# EAGLE design ZoomFloppy_v1.0a (EAGLE 7.7.0)
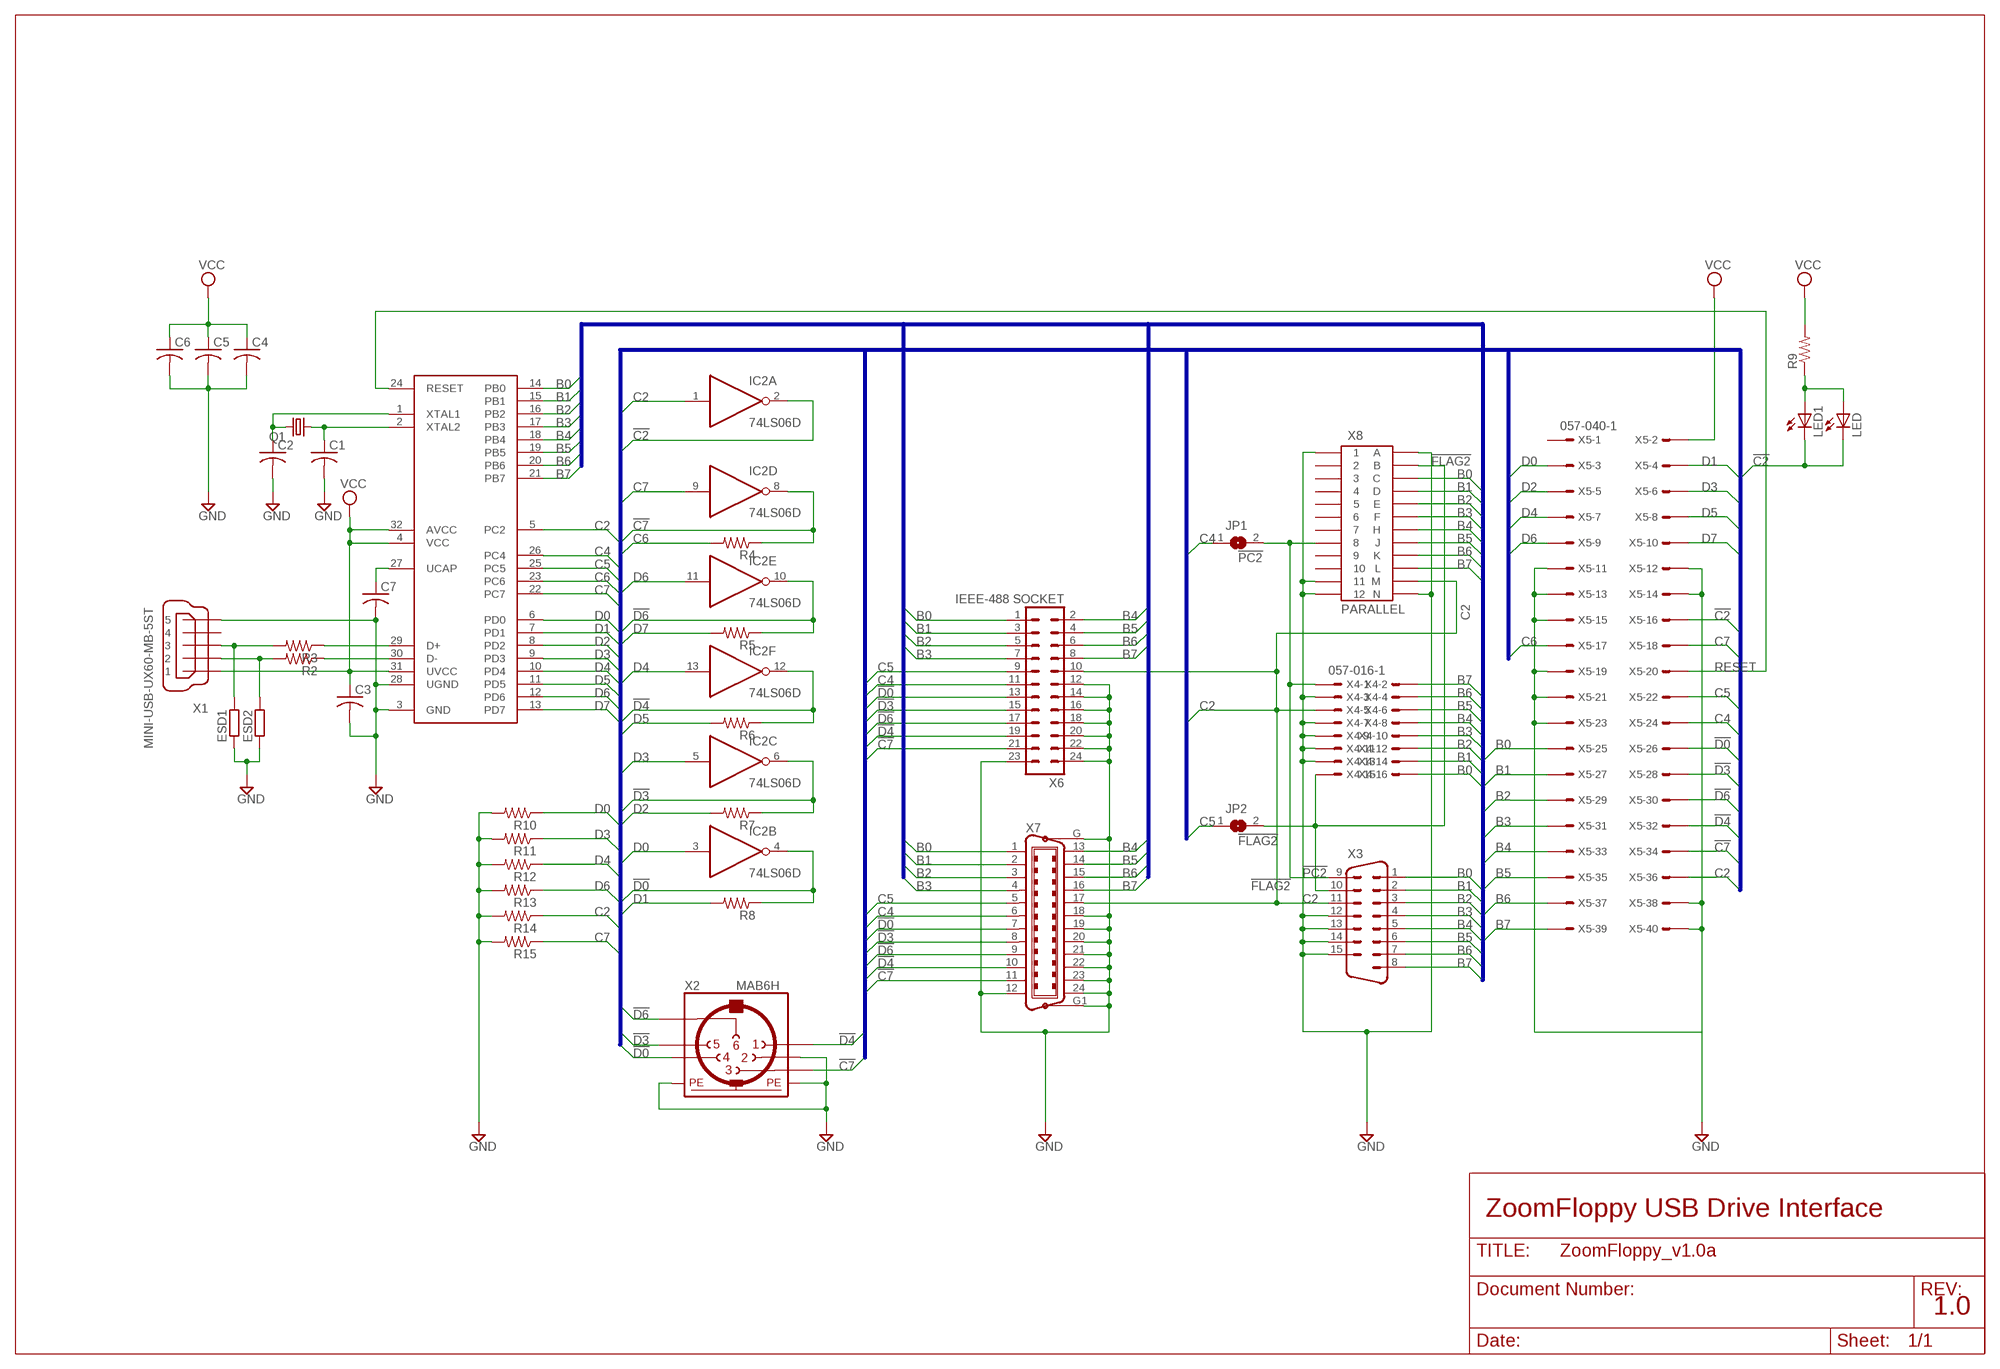
[diagram p0: schematic, sheet 1]

## Parts
C1  C-USC0402  [C0402]
C2  C-USC0402  [C0402]
C3  C-USC0402  [C0402]
C4  C-USC0402  [C0402]
C5  C-USC0402  [C0402]
C6  C-USC0402  [C0402]
C7  C-USC0402  [C0402]
ESD1  R-EU_R0603  [R0603]
ESD2  R-EU_R0603  [R0603]
IC1  ATMEGA32U2  AT90USB162  [VQFP32]
IC2  74LS06D  [SO14]
JP1  SJ  [SJ]
JP2  SJ  [SJ]
LED  LED3MM  [LED3MM]
LED1  LEDCHIP-LED0805  [CHIP-LED0805]
Q1  CRYSTALHC49UP  [HC49UP]
R2  R-US_R0402  [R0402]
R3  R-US_R0402  [R0402]
R4  R-US_R0402  [R0402]
R5  R-US_R0402  [R0402]
R6  R-US_R0402  [R0402]
R7  R-US_R0402  [R0402]
R8  R-US_R0402  [R0402]
R9  R-US_R0402  [R0402]
R10  R-US_R0402  [R0402]
R11  R-US_R0402  [R0402]
R12  R-US_R0402  [R0402]
R13  R-US_R0402  [R0402]
R14  R-US_R0402  [R0402]
R15  R-US_R0402  [R0402]
X1  MINI-USB-UX60-MB-5ST  [UX60-MB-5ST]
X2  MAB6H  [MAB6H]
X3  M15-182  [182-015-MALE]
X4  057-016-1  [057-016-1]
X5  057-040-1  [057-040-1]
X6  IEEE-488 SOCKET  MA12-2  [MA12-2]
X7  C24HP  [24HP]
X8  PARALLEL  MA-24  [MA-24]

## Nets
!C2: IC2.2(A:O) LED1.C LED.K(C) X5.16
!C7: IC2.8(D:O) R4.1 X2.3 X5.34 X6.21 X7.11
!D0: IC2.4(B:O) R8.1 X2.4 X5.26 X6.13 X7.7
!D3: IC2.6(C:O) R7.1 X2.5 X5.28 X6.15 X7.8
!D4: IC2.12(F:O) R6.1 X2.1 X5.32 X6.19 X7.10
!D6: IC2.10(E:O) R5.1 X2.6 X5.30 X6.17 X7.9
!FLAG2: JP2.2 X3.10 X4.15 X8.B
!PC2: JP1.2 X3.9 X4.1 X8.8
B0: IC1.14(PB0) X3.1 X4.16 X5.25 X6.1 X7.1 X8.C
B1: IC1.15(PB1) X3.2 X4.14 X5.27 X6.3 X7.2 X8.D
B2: IC1.16(PB2) X3.3 X4.12 X5.29 X6.5 X7.3 X8.E
B3: IC1.17(PB3) X3.4 X4.10 X5.31 X6.7 X7.4 X8.F
B4: IC1.18(PB4) X3.5 X4.8 X5.33 X6.2 X7.13 X8.H
B5: IC1.19(PB5) X3.6 X4.6 X5.35 X6.4 X7.14 X8.J
B6: IC1.20(PB6) X3.7 X4.4 X5.37 X6.6 X7.15 X8.K
B7: IC1.21(PB7) X3.8 X4.2 X5.39 X6.8 X7.16 X8.L
C2: IC1.5(PC2) IC2.1(A:I) R14.1 X3.11 X4.5 X5.36 X6.10 X7.17 X8.M
C4: IC1.26(PC4) JP1.1 X5.24 X6.11 X7.6
C5: IC1.25(PC5) JP2.1 X5.22 X6.9 X7.5
C6: IC1.23(PC6) R4.2 X5.17
C7: IC1.22(PC7) IC2.9(D:I) R15.1 X5.18
D0: IC1.6(PD0) IC2.3(B:I) R10.1 X5.3
D1: IC1.7(PD1) R8.2 X5.4
D2: IC1.8(PD2) R7.2 X5.5
D3: IC1.9(PD3) IC2.5(C:I) R11.1 X5.6
D4: IC1.10(PD4) IC2.13(F:I) R12.1 X5.7
D5: IC1.11(PD5) R6.2 X5.8
D6: IC1.12(PD6) IC2.11(E:I) R13.1 X5.9
D7: IC1.13(PD7) R5.2 X5.10
D+: IC1.29(D+) R3.1
D+': ESD1.2 R3.2 X1.3
D-: IC1.30(D-) R2.1
D-': ESD2.2 R2.2 X1.2
GND: C1.2 C2.2 C3.2 C4.2 C5.2 C6.2 C7.2 ESD1.1 ESD2.1 IC1.3(GND) IC1.28(UGND) R10.2 R11.2 R12.2 R13.2 R14.2 R15.2 X1.5 X2.2 X2.PE X2.PE@(PE) X3.12 X3.13 X3.14 X3.15 X4.3 X4.7 X4.9 X4.11 X4.13 X5.11 X5.12 X5.13 X5.14 X5.15 X5.19 X5.21 X5.23 X5.38 X5.40 X6.12 X6.14 X6.16 X6.18 X6.20 X6.22 X6.23 X6.24 X7.12 X7.18 X7.19 X7.20 X7.21 X7.22 X7.23 X7.24 X7.G X7.G1 X8.1 X8.11 X8.12 X8.A X8.N
N$1: C2.1 IC1.1(XTAL1) Q1.2
N$2: C1.1 IC1.2(XTAL2) Q1.1
N$3: LED1.A LED.A R9.1
N$12: C7.1 IC1.27(UCAP)
RESET: IC1.24(RESET) X5.20
VCC: C3.1 C4.1 C5.1 C6.1 IC1.4(VCC) IC1.31(UVCC) IC1.32(AVCC) R9.2 X1.1 X5.2
Unconnected: X1.4 X5.1 X8.2 X8.3 X8.4 X8.5 X8.6 X8.7 X8.9 X8.10

## Buses
C2,C4,C5,C6,C7,D[0..7],!C2,!C7,!D0,!D3,!D4,!D6,!D7
B[0..7]

## Notes on the sheet
- ZoomFloppy USB Drive Interface
- 1.0

## Power pins joined to a net without a drawn wire
GND: IC2.7(P:GND)
VCC: IC2.14(P:VCC)

## Library data of the parts
C1-C7 = rcl:C-US: CAPACITOR, American symbol
ESD1 ESD2 = rcl:R-EU_: RESISTOR, European symbol
IC1 = at90usb:AT90USB162
IC2 = 74xx-us:74*06: Hex INVERTER, open collector high-voltage output
JP1 JP2 = jumper:SJ: SMD solder JUMPER
LED LED1 = led:LED: LED OSRAM: - CHIPLED LG R971, LG N971, LY N971, LG Q971, LY Q971, LO R971, LY R971 LH N974, LH R974 LS Q976, LO Q976, LY Q976 LO Q996 - Hyper CHIPLED LW Q18S LB Q993, LB Q99A, LB R99A - SideLED LS A670, LO A670, LY A670, LG A670, LP A670 LB A673, LV A673, LT A673, LW A673 LH A674 LY A675 LS A676, LA A676, LO A676, LY A676, LW A676 LS A679, LY A679, LG A679 - Hyper Micro SIDELED® LS Y876, LA Y876, LO Y876, LY Y876 LT Y87S - SmartLED LW L88C, LW L88S LB L89C, LB L89S, LG L890 LS L89K, LO L89K, LY L89K LS L896, LA L896, LO L896, LY L896 - TOPLED LS T670, LO T670, LY T670, LG T670, LP T670 LSG T670, LSP T670, LSY T670, LOP T670, LYG T670 LG T671, LOG T671, LSG T671 LB T673, LV T673, LT T673, LW T673 LH T674 LS T676, LA T676, LO T676, LY T676, LB T676, LH T676, LSB T676, LW T676 LB T67C, LV T67C, LT T67C, LS T67K, LO T67K, LY T67K, LW E67C LS E67B, LA E67B, LO E67B, LY E67B, LB E67C, LV E67C, LT E67C LW T67C LS T679, LY T679, LG T679 LS T770, LO T770, LY T770, LG T770, LP T770 LB T773, LV T773, LT T773, LW T773 LH T774 LS E675, LA E675, LY E675, LS T675 LS T776, LA T776, LO T776, LY T776, LB T776 LHGB T686 LT T68C, LB T68C - Hyper Mini TOPLED® LB M676 - Mini TOPLED Santana® LG M470 LS M47K, LO M47K, LY M47K Source: http://www.osram.convergy.de LUXEON: - LUMILED® LXK2-PW12-R00, LXK2-PW12-S00, LXK2-PW14-U00, LXK2-PW14-V00 LXK2-PM12-R00, LXK2-PM12-S00, LXK2-PM14-U00 LXK2-PE12-Q00, LXK2-PE12-R00, LXK2-PE12-S00, LXK2-PE14-T00, LXK2-PE14-U00 LXK2-PB12-K00, LXK2-PB12-L00, LXK2-PB12-M00, LXK2-PB14-N00, LXK2-PB14-P00, LXK2-PB14-Q00 LXK2-PR12-L00, LXK2-PR12-M00, LXK2-PR14-Q00, LXK2-PR14-R00 LXK2-PD12-Q00, LXK2-PD12-R00, LXK2-PD12-S00 LXK2-PH12-R00, LXK2-PH12-S00 LXK2-PL12-P00, LXK2-PL12-Q00, LXK2-PL12-R00 Source: www.luxeon.com KINGBRIGHT: KA-3528ASYC Source: www.kingbright.com
Q1 = crystal:CRYSTAL: CRYSTAL
R2-R15 = resistor:R-US_: RESISTOR, American symbol
X1 = con-hirose-jlb:MINI-USB-: MINI USB Connector Source: http://www.hirose.co.jp/cataloge_hp/e24000019.pdf; OC_FARNELL: unknown; OC_NEWARK: unknown
X2 = con-hirschmann:MAB6H: Female CONNECTOR 6 pins with shield, horizontal (DIN 45322)
X3 = con-subd:M15: SUB-D
X4 = con-panduit:057-016-: CONNECTOR 10-pin series 057 contact pc board low profile headers
X5 = con-panduit:057-040-: CONNECTOR 40-pin series 057 contact pc board low profile headers
X6 = con-lstb:MA12-2: PIN HEADER
X7 = con-amp-champ:C24HP: CONNECTOR
X8 = con-edge-156:MA-24

## Board
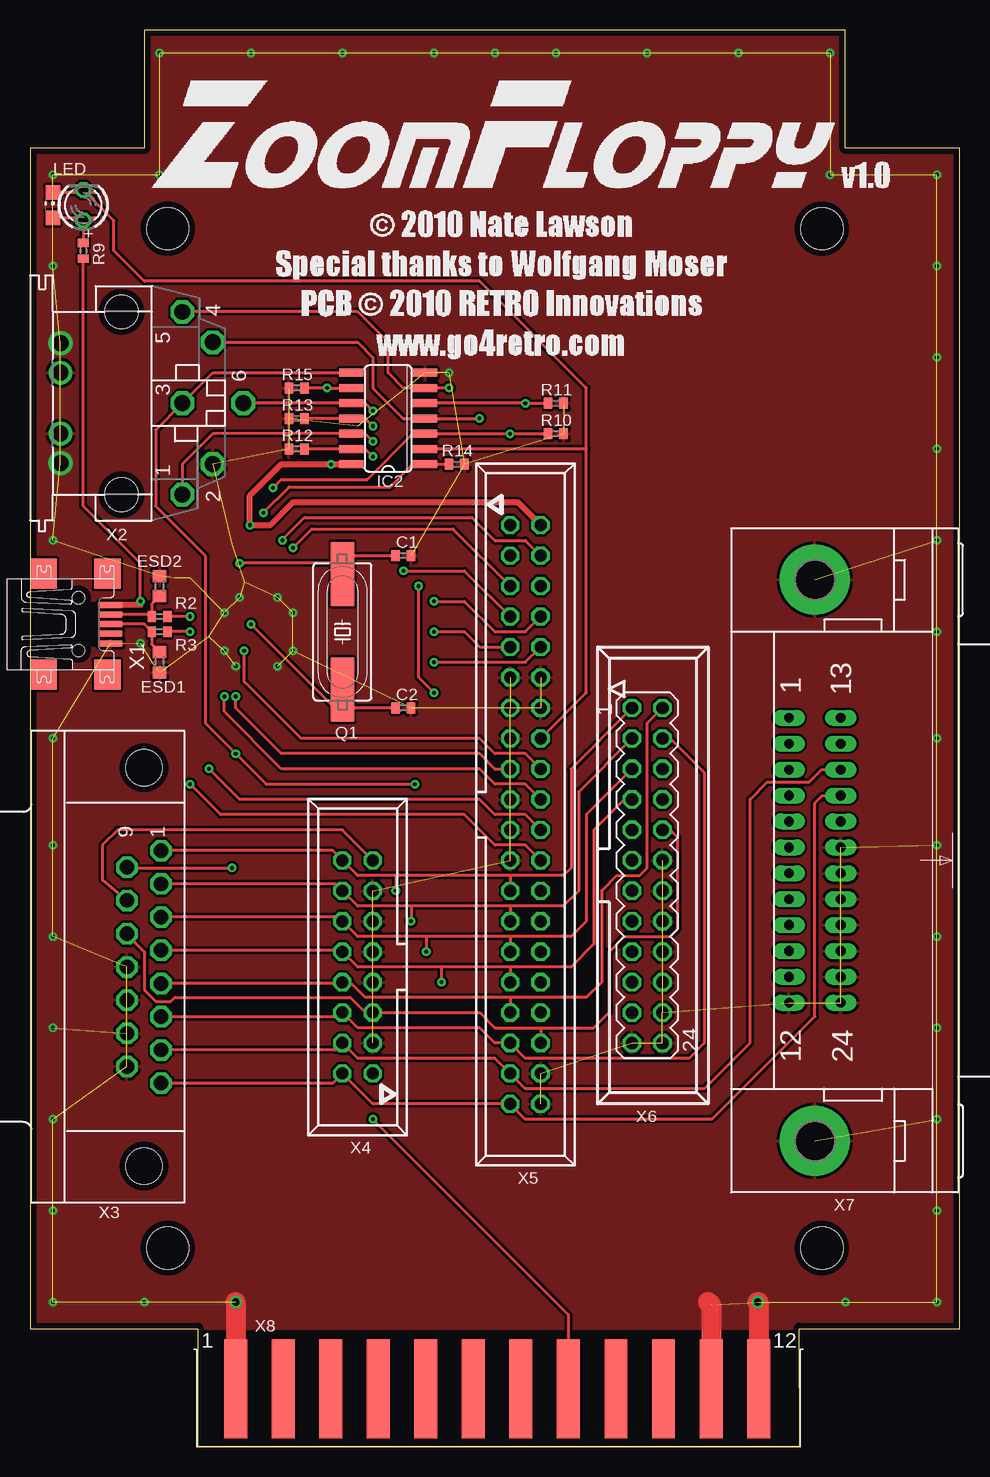
[diagram p1: board, top side]
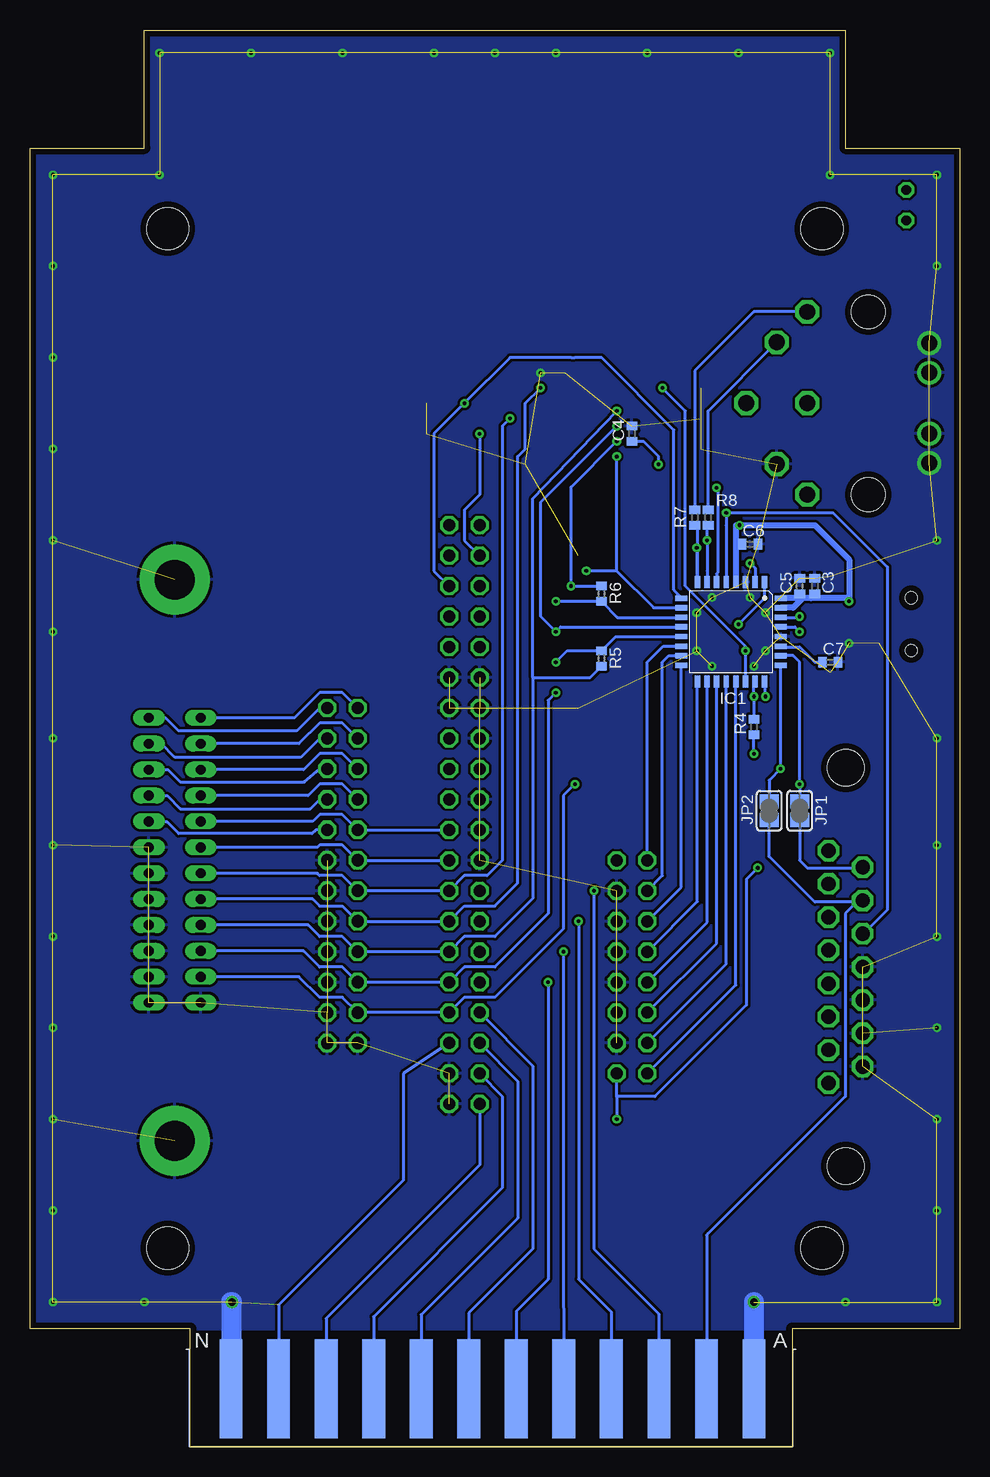
[diagram p2: board, bottom side, seen from below]

Size 77.47 x 118.11 mm. Coordinates in mm from the lower left corner, seen from the top.
Outline: 13.97,0 64.13,0 64.11,9.84 77.47,9.84 77.47,108.27 67.94,108.27 67.94,118.11 9.53,118.11 9.53,108.27 0,108.27 0,9.84 13.97,9.84 13.97,0
Copper layers (1*16): Top 0.035mm / dielectric 1.5mm / Bottom 0.035mm
Design rules "default *": minimum track width 10mil, minimum drill 12mil, track to track 8mil, track to pad 8mil, pad to pad 8mil, via to via 8mil, smd to smd 8mil, copper to edge 20mil, drill to drill 8mil, minimum pad ring 10mil, minimum via ring 8mil, stop-mask expansion 4mil, vias tented up to drill 0mil, thermal gap 10mil
Holes 3.51 mm at 11.48,101.55 65.99,101.55 11.48,16.56 65.99,16.56

### Footprints (pad centres in the part's own frame; a part is rotated, then mirrored left to right if it is on the bottom)
C0402 = smd 0.7 x 0.9: 1 -0.65,0; 2 0.65,0
R0603 = smd 1 x 1.1: 1 -0.85,0; 2 0.85,0
VQFP32 = smd 1 x 0.45: 1 -4.15,2.8; 2 -4.15,2; 3 -4.15,1.2; 4 -4.15,0.4; 5 -4.15,-0.4; 6 -4.15,-1.2; 7 -4.15,-2; 8 -4.15,-2.8; 17 4.15,-2.8; 18 4.15,-2; 19 4.15,-1.2; 20 4.15,-0.4; 21 4.15,0.4; 22 4.15,1.2; 23 4.15,2; 24 4.15,2.8 | smd 0.45 x 1: 9 -2.8,-4.15; 10 -2,-4.15; 11 -1.2,-4.15; 12 -0.4,-4.15; 13 0.4,-4.15; 14 1.2,-4.15; 15 2,-4.15; 16 2.8,-4.15; 25 2.8,4.15; 26 2,4.15; 27 1.2,4.15; 28 0.4,4.15; 29 -0.4,4.15; 30 -1.2,4.15; 31 -2,4.15; 32 -2.8,4.15
SO14 = smd 0.66 x 2.032: 1 -3.81,-3.073; 2 -2.54,-3.073; 3 -1.27,-3.073; 4 0,-3.073; 5 1.27,-3.073; 6 2.54,-3.073; 7 3.81,-3.073; 8 3.81,3.073; 9 2.54,3.073; 10 1.27,3.073; 11 0,3.073; 12 -1.27,3.073; 13 -2.54,3.073; 14 -3.81,3.073
SJ = smd 1.168 x 1.6: 1 -0.762,0; 2 0.762,0
LED3MM = drill 0.813 octagon: A -1.27,0; K 1.27,0
CHIP-LED0805 = smd 1.2 x 1.2: A 0,-1.05; C 0,1.05
HC49UP = smd 5.334 x 1.93: 1 -4.826,0; 2 4.826,0
R0402 = smd 0.7 x 0.9: 1 -0.65,0; 2 0.65,0
UX60-MB-5ST = smd 2 x 0.5: 1 2.25,1.6; 2 2.25,0.8; 3 2.25,0; 4 2.25,-0.8; 5 2.25,-1.6 | smd 2.2 x 2.5: M1 -3.3,-4.2; M2 -3.3,4.2; M3 2,4.2; M4 2,-4.2 | hole 1: -0.4,-2.2; -0.4,2.2
MAB6H = drill 1.321 octagon: 1 7.62,5.08; 2 5.08,7.62; 3 0,5.08; 4 -5.08,7.62; 5 -7.62,5.08; 6 0,10.16 | drill 1.321: PE -2.54,-5.08; PE@ 2.54,-5.08 | hole 2.794: 7.62,0; -7.62,0
182-015-MALE = drill 1.194 pad 1.524 octagon: 1 -9.69,10.923; 2 -6.921,10.923; 3 -4.153,10.923; 4 -1.384,10.923; 5 1.384,10.923; 6 4.153,10.923; 7 6.921,10.923; 8 9.69,10.923; 9 -8.306,8.08; 10 -5.537,8.08; 11 -2.769,8.08; 12 0,8.08; 13 2.769,8.08; 14 5.537,8.08; 15 8.306,8.08 | hole 3.048: -16.599,9.501; 16.599,9.501
057-016-1 = drill 1 octagon: 1 -8.89,-1.27; 2 -8.89,1.27; 3 -6.35,-1.27; 4 -6.35,1.27; 5 -3.81,-1.27; 6 -3.81,1.27; 7 -1.27,-1.27; 8 -1.27,1.27; 9 1.27,-1.27; 10 1.27,1.27; 11 3.81,-1.27; 12 3.81,1.27; 13 6.35,-1.27; 14 6.35,1.27; 15 8.89,-1.27; 16 8.89,1.27
057-040-1 = drill 1 octagon: 1 -24.13,-1.27; 2 -24.13,1.27; 3 -21.59,-1.27; 4 -21.59,1.27; 5 -19.05,-1.27; 6 -19.05,1.27; 7 -16.51,-1.27; 8 -16.51,1.27; 9 -13.97,-1.27; 10 -13.97,1.27; 11 -11.43,-1.27; 12 -11.43,1.27; 13 -8.89,-1.27; 14 -8.89,1.27; 15 -6.35,-1.27; 16 -6.35,1.27; 17 -3.81,-1.27; 18 -3.81,1.27; 19 -1.27,-1.27; 20 -1.27,1.27; 21 1.27,-1.27; 22 1.27,1.27; 23 3.81,-1.27; 24 3.81,1.27; 25 6.35,-1.27; 26 6.35,1.27; 27 8.89,-1.27; 28 8.89,1.27; 29 11.43,-1.27; 30 11.43,1.27; 31 13.97,-1.27; 32 13.97,1.27; 33 16.51,-1.27; 34 16.51,1.27; 35 19.05,-1.27; 36 19.05,1.27; 37 21.59,-1.27; 38 21.59,1.27; 39 24.13,-1.27; 40 24.13,1.27
MA12-2 = drill 1.016 octagon: 1 -13.97,-1.27; 2 -13.97,1.27; 3 -11.43,-1.27; 4 -11.43,1.27; 5 -8.89,-1.27; 6 -8.89,1.27; 7 -6.35,-1.27; 8 -6.35,1.27; 9 -3.81,-1.27; 10 -3.81,1.27; 11 -1.27,-1.27; 12 -1.27,1.27; 13 1.27,-1.27; 14 1.27,1.27; 15 3.81,-1.27; 16 3.81,1.27; 17 6.35,-1.27; 18 6.35,1.27; 19 8.89,-1.27; 20 8.89,1.27; 21 11.43,-1.27; 22 11.43,1.27; 23 13.97,-1.27; 24 13.97,1.27
24HP = drill 0.813 long: 1 -11.874,-2.159; 2 -9.716,-2.159; 3 -7.556,-2.159; 4 -5.397,-2.159; 5 -3.239,-2.159; 6 -1.079,-2.159; 7 1.079,-2.159; 8 3.239,-2.159; 9 5.397,-2.159; 10 7.556,-2.159; 11 9.716,-2.159; 12 11.874,-2.159; 13 -11.874,2.159; 14 -9.716,2.159; 15 -7.556,2.159; 16 -5.397,2.159; 17 -3.239,2.159; 18 -1.079,2.159; 19 1.079,2.159; 20 3.239,2.159; 21 5.397,2.159; 22 7.556,2.159; 23 9.716,2.159; 24 11.874,2.159 | drill 3.302 pad 5.842: G -23.393,0; G1 23.393,0
MA-24 = smd 1.905 x 8.255: 1 -21.285,-0.254; 2 -17.323,-0.254; 3 -13.36,-0.254; 4 -9.398,-0.254; 5 -5.436,-0.254; 6 -1.473,-0.254; 7 2.489,-0.254; 8 6.452,-0.254; 9 10.414,-0.254; 10 14.376,-0.254; 11 18.339,-0.254; 12 22.301,-0.254 | smd 1.905 x 8.255 bottom: A -21.285,-0.254; B -17.323,-0.254; C -13.36,-0.254; D -9.398,-0.254; E -5.436,-0.254; F -1.473,-0.254; H 2.489,-0.254; J 6.452,-0.254; K 10.414,-0.254; L 14.376,-0.254; M 18.339,-0.254; N 22.301,-0.254

### Placement (x,y rotation side)
C1  31.11,74.3 0 top
C2  31.11,61.59 0 top
C3  12.06,71.75 90 bottom
C4  27.3,84.45 90 bottom
C5  13.34,71.75 90 bottom
C6  17.46,75.25 0 bottom
C7  10.79,65.41 0 bottom
ESD1  10.79,65.41 90 top
ESD2  10.79,71.75 270 top
IC1  19.05,67.94 270 bottom
IC2  29.84,85.72 90 top
JP1  13.34,53.02 270 bottom
JP2  15.88,53.02 270 bottom
LED  4.45,103.5 90 top
LED1  1.91,103.5 0 top
Q1  26.04,67.94 270 top
R2  10.79,69.21 180 top
R3  10.79,67.94 180 top
R4  17.14,60.01 90 bottom
R5  29.84,65.72 90 bottom
R6  29.84,71.12 270 bottom
R7  22.07,77.47 270 bottom
R8  20.95,77.47 270 bottom
R9  4.45,99.69 270 top
R10  43.82,84.45 0 top
R11  43.82,86.99 0 top
R12  22.22,83.18 180 top
R13  22.22,85.72 180 top
R14  35.56,81.91 0 top
R15  22.22,88.27 180 top
X1  4.45,68.58 0 top
X2  7.62,86.99 270 top
X3  0,40.01 270 top
X4  27.3,40.01 90 top
X5  41.27,52.71 270 top
X6  51.44,47.62 270 top
X7  65.41,48.9 270 top
X8  38.42,5.08 0 top

### Tracks (layer width: path | path; a pad name or v marks a point on that pad's centre or on a via)
!C2
  Top 0.254: 46.36,83.18 46.36,88.27 37.47,97.16 9.53,97.16 6.99,99.69 6.99,102.23 LED.K 5.5,104.55 LED1.C | IC2.2 37.47,83.18 46.36,83.18 | 46.36,83.18 46.36,62.87 X5.16
!C7  (via drill 0.3)
  Top 0.254: IC2.8 15.24,89.53 X2.3 10.48,84.77 10.48,78.42 14.61,74.3 14.61,60.33 v17.14,57.79 19.68,55.25 v32.07,55.25
  Bottom 0.254: X7.11 55.05,39.18 53.34,37.47 51.44,37.47 X6.21 X5.34 41.27,37.47 38.73,37.47 33.02,43.18 33.02,54.29 v32.07,55.25 | v17.14,57.79 R4.1
!D0  (via drill 0.3)
  Top 0.254: X2.4 27.3,92.07 28.57,90.8 28.57,88.27 31.11,85.72 IC2.4 v37.47,85.72
  Bottom 0.254: R8.1 20.95,86.36 X2.4 | v37.47,85.72 38.1,85.09 38.1,48.9 39.37,47.62 41.27,47.62 X5.26 X6.13 51.44,47.62 53.34,47.62 53.53,47.82 X7.7
!D3  (via drill 0.3)
  Top 0.254: X2.5 27.3,94.61 29.84,92.07 29.84,89.53 31.11,88.27 32.39,88.27 IC2.6 v34.93,88.27
  Bottom 0.254: v34.93,88.27 36.2,86.99 36.2,83.18 36.83,82.55 36.83,46.99 38.73,45.09 41.27,45.09 X5.28 X6.15 51.37,45.02 51.44,45.09 53.34,45.09 53.91,45.66 X7.8 | R7.1 22.07,89.69 17.14,94.61 X2.5
!D4  (via drill 0.3)
  Top 0.254: X2.1 12.7,81.91 15.24,84.45 IC2.12 27.94,84.45 v28.57,83.82 | v33.66,62.87 32.39,64.13 v32.39,71.75
  Bottom 0.254: v33.66,62.87 34.29,62.23 34.29,44.45 38.73,40.01 41.27,40.01 X5.32 X6.19 51.44,40.01 53.34,40.01 54.67,41.34 X7.10 | v28.57,83.82 32.39,80.01 v32.39,71.75 | v32.39,71.75 32.4,71.75 | v32.39,71.75 29.86,71.75 R6.1
!D6  (via drill 0.3)
  Top 0.254: X2.6 IC2.10 27.94,86.99 v28.57,86.36
  Bottom 0.254: 35.56,64.13 35.56,45.72 38.73,42.55 41.27,42.55 X5.30 X6.17 51.44,42.55 53.34,42.55 54.29,43.5 X7.9 | R5.1 30.78,64.13 35.56,64.13 | v28.57,86.36 35.56,79.06 35.56,64.13
!FLAG2
  Top 0.254: X4.15 26.04,51.44 7.3,51.44 6.03,50.16 6.03,47.27 X3.10
  Bottom 0.254: X8.B 21.09,17.64 20.95,17.78 9.53,29.21 9.53,44.45 8.43,45.54 X3.10 8.85,45.4 12.06,45.4 15.88,49.21 JP2.2
!PC2  (via drill 0.3)
  Top 0.254: X8.8 44.87,11.01 v28.57,27.3 | v16.83,48.26 7.81,48.26 X3.9
  Bottom 0.254: JP1.2 13.34,48.9 12.7,48.26 8.13,48.26 X3.9 | 28.57,29.21 v28.57,27.3 | 28.57,29.21 X4.1 | 28.57,29.21 25.4,29.21 17.78,36.83 17.78,47.31 v16.83,48.26
B0  (via drill 0.3)
  Top 0.254: X3.1 25.23,49.7 X4.16 27.3,47.62 30.48,47.62 | 30.48,47.62 v30.48,46.36 | 40.01,47.62 30.48,47.62 | 40.01,47.62 44.45,47.62 45.09,48.26 45.09,56.52 X6.1 | 40.01,47.62 X5.25
  Bottom 0.254: X7.1 55.44,60.77 53.34,62.87 51.44,62.87 X6.1 | IC1.14 24.69,66.74 26.04,65.41 X4.16 | v30.48,46.36 30.48,16.51 25.06,11.09 X8.C
B1  (via drill 0.3)
  Top 0.254: X3.2 25.46,46.93 X4.14 27.3,45.09 31.75,45.09 | 31.75,45.09 v31.75,43.82 | 40.01,45.09 31.75,45.09 | 40.01,45.09 44.45,45.09 45.72,46.36 45.72,54.61 X6.3 | 40.01,45.09 X5.27
  Bottom 0.254: X7.2 55.05,58.61 53.34,60.33 51.44,60.33 X6.3 | IC1.15 24.22,65.94 24.76,65.41 24.76,47.62 X4.14 | v31.75,43.82 31.75,13.97 29.02,11.24 X8.D
B2  (via drill 0.3)
  Top 0.254: X3.3 25.69,44.16 X4.12 27.3,42.55 33.02,42.55 | X6.5 46.36,52.71 46.36,43.82 45.09,42.55 40.01,42.55 | 40.01,42.55 33.02,42.55 | 33.02,42.55 v33.02,41.27 | 40.01,42.55 X5.29
  Bottom 0.254: X7.3 54.67,56.45 53.34,57.79 51.44,57.79 X6.5 | IC1.16 23.2,46.65 X4.12 | X8.E 32.98,11.39 33.02,11.75 v33.02,41.27
B3  (via drill 0.3)
  Top 0.254: X3.4 25.92,41.39 X4.10 27.3,40.01 34.29,40.01 | X6.7 49.53,53.98 46.99,51.44 46.99,41.91 45.09,40.01 40.01,40.01 | 40.01,40.01 34.29,40.01 | 34.29,40.01 v34.29,38.73 | 40.01,40.01 X5.31
  Bottom 0.254: X7.4 54.29,54.29 53.34,55.25 51.44,55.25 X6.7 | IC1.17 21.85,45.46 X4.10 | v34.29,38.73 34.29,38.42 34.29,13.97 36.94,11.32 X8.F
B4
  Top 0.254: 25.92,38.62 X3.5 | 25.92,38.62 X4.8 | 25.92,38.62 26.78,38.62 27.94,37.47 40.01,37.47 | X6.2 51.44,60.33 51.44,48.26 50.8,47.62 48.9,47.62 47.62,46.36 47.62,38.73 46.36,37.47 40.01,37.47 | 40.01,37.47 X5.33
  Bottom 0.254: IC1.18 21.05,43.72 X4.8 | X8.H 40.91,11.16 35.56,16.51 35.56,31.75 X5.33 | X7.13 66.17,60.77 65.09,59.69 55.25,59.69 53.34,61.59 X6.2
B5
  Top 0.254: X3.6 25.69,35.85 X4.6 27.3,34.93 37.47,34.93 38.73,33.66 X5.35 41.27,32.39 54.93,32.39 56.2,33.66 56.2,56.2 53.34,59.05 X6.4
  Bottom 0.254: IC1.19 20.25,41.98 X4.6 | X8.J 44.87,11.01 36.83,19.05 36.83,30.48 X5.35 | X7.14 66.55,58.61 65.41,57.47 54.93,57.47 53.34,59.05 X6.4
B6
  Top 0.254: X3.7 25.46,33.08 X4.4 27.3,32.39 38.73,32.39 X5.37 41.27,29.84 56.2,29.84 60.01,33.66 60.01,53.98 61.44,55.4 64.93,55.4 65.98,56.45 X7.15
  Bottom 0.254: IC1.20 19.45,40.24 X4.4 | X8.K 48.83,10.86 38.1,21.59 38.1,29.21 X5.37 | X6.6 53.34,56.52 54.61,55.4 64.93,55.4 65.98,56.45 X7.15
B7
  Top 0.254: X3.8 25.23,30.31 X4.2 28.57,28.57 X5.39 41.27,27.3 56.83,27.3 65.41,35.88 65.41,53.66 66.04,54.29 X7.16
  Bottom 0.254: X7.16 66.04,54.29 64.93,53.18 54.13,53.18 53.34,53.98 X6.8 | IC1.21 18.65,38.5 X4.2 | X8.L 52.79,10.71 40.01,23.49 X5.39
C2  (via drill 0.3)
  Top 0.254: X3.11 8.08,42.72 9.53,41.27 9.53,38.1 10.48,37.15 11.75,37.15 12.06,37.47 26.67,37.47 27.94,36.2 X4.5 37.47,36.2 38.73,34.93 42.55,34.93 | X6.10 53.34,51.44 53.98,50.8 53.98,43.18 53.34,42.55 49.53,42.55 48.26,41.27 48.26,36.2 46.99,34.93 42.55,34.93 | R14.1 IC2.1 31.91,81.91 30,80.01 21.59,80.01 v19.45,77.87 | 42.55,34.93 X5.36
  Bottom 0.254: X7.17 67.82,52.07 66.04,52.07 65.09,51.12 53.98,51.12 53.66,51.44 X6.10 53.34,51.44 | X8.M 56.76,11.82 46.36,22.22 46.36,31.11 X5.36 | IC1.5 19.45,76.83 v19.45,77.87 10.56,77.87 6.03,73.34 6.03,44.77 8.03,42.77 X3.11
C4  (via drill 0.3)
  Top 0.254: v13.34,55.25 15.88,52.71 36.2,52.71 38.73,50.16 41.27,50.16 X5.24
  Bottom 0.254: IC1.26 13.88,65.94 13.34,65.41 v13.34,55.25 JP1.1 | X5.24 X6.11 51.44,50.16 53.34,50.16 53.53,49.97 X7.6
C5  (via drill 0.3)
  Top 0.254: v14.92,56.52 17.46,53.98 37.47,53.98 38.73,52.71 41.27,52.71 X5.22
  Bottom 0.254: 14.9,56.54 IC1.25 | 14.9,56.54 14.9,56.52 v14.92,56.52 | 14.9,56.54 15.88,55.56 JP2.1 | X7.5 53.91,52.13 53.34,52.71 51.44,52.71 X6.9 X5.22
C6  (via drill 0.3)
  Top 0.254: v17.14,62.55 17.14,61.59 20.95,57.79 37.47,57.79 38.73,56.52 X5.17
  Bottom 0.254: IC1.23 17.14,63.7 v17.14,62.55 R4.2
C7  (via drill 0.3)
  Top 0.254: R15.1 v24.76,88.27 26.04,88.27 IC2.9 | v17.85,66.36 IC1.22 22.59,59.05 37.47,59.05 38.73,57.79 41.27,57.79 X5.18
  Bottom 0.254: IC1.22 v17.85,66.36 17.85,66.74 22.86,71.75 22.86,86.36 v24.76,88.27
D0  (via drill 0.3)
  Top 0.254: R10.1 v40.01,84.45 IC2.3 31.91,84.45 28.1,80.64 20.95,80.64 v20.25,79.94
  Bottom 0.254: IC1.6 20.25,72.78 20.16,72.87 20.16,79.85 20.25,79.85 v20.25,79.94 | v40.01,84.45 40.01,79.38 41.27,78.1 41.27,75.56 X5.3
D1  (via drill 0.3)
  Top 0.254: v21.05,75.56 21.05,75.66 22.86,77.47 36.83,77.47 38.73,75.56 41.27,75.56 X5.4
  Bottom 0.254: IC1.7 21.05,73.02 v21.05,75.56 21.05,76.72 R8.2
D2  (via drill 0.3)
  Top 0.254: v21.91,74.93 23.49,76.52 35.24,76.52 X5.5
  Bottom 0.254: R7.2 21.85,76.76 IC1.8 21.85,74.87 v21.91,74.93
D3  (via drill 0.3)
  Top 0.254: IC2.5 v41.27,86.99 R11.1
  Bottom 0.254: IC1.9 23.18,70.77 23.49,71.08 23.81,71.44 23.81,84.77 29.84,90.8 32.07,90.8 32.39,90.8 37.47,90.8 v41.27,86.99 43.82,84.45 43.82,73.02 X5.6
D4  (via drill 0.3)
  Top 0.254: R12.1 IC2.13 27.94,83.18 v28.57,82.55 | v31.11,73.02 36.2,73.02 X5.7
  Bottom 0.254: IC1.10 25.49,69.94 28.57,73.02 | 28.57,73.02 v28.57,82.55 | 28.57,73.02 v31.11,73.02
D5  (via drill 0.3)
  Top 0.254: v33.66,70.48 36.2,70.48 38.73,67.94 41.27,67.94 X5.8
  Bottom 0.254: v33.66,70.48 R6.2 28.52,69.14 IC1.11
D6  (via drill 0.3)
  Top 0.254: R13.1 IC2.11 27.94,85.72 v28.57,85.09 | X5.9 37.47,66.67 36.2,67.94 v33.66,67.94
  Bottom 0.254: IC1.12 33.26,68.34 v33.66,67.94 34.93,69.21 34.93,78.74 v28.57,85.09
D7  (via drill 0.3)
  Top 0.254: v33.66,65.41 41.27,65.41 X5.10
  Bottom 0.254: IC1.13 28.67,67.55 R5.2 32.69,66.37 v33.66,65.41
D+  (via drill 0.3)
  Top 0.254: v13.34,67.94 R3.1
  Bottom 0.254: IC1.29 13.73,68.34 v13.34,67.94
D+'
  Top 0.254: X1.3 9.51,68.58 R3.2 10.14,66.91 ESD1.2
D-  (via drill 0.3)
  Top 0.254: v13.34,69.21 R2.1
  Bottom 0.254: IC1.30 13.4,69.14 v13.34,69.21
D-'
  Top 0.254: ESD2.2 10.14,70.25 R2.2 arc90 9.98,69.38 X1.2
GND  (via drill 0.3, 0.61, 1.35)  (109 unrouted)
  Top 1.676: v17.14,12.06 X8.A | v60.64,12.06 60.72,12.06 X8.N | X8.11 56.76,11.82 56.52,12.06
  Bottom 1.676: v17.14,12.06 X8.A | X8.N 60.72,12.06 v60.64,12.06
  other vias: 16.19,69.53 16.19,66.36 20.64,70.8 20.64,65.09 17.46,70.8 21.91,66.36 21.91,69.53 17.14,65.09 34.93,89.53 9.21,66.99 1.91,106.05 1.91,98.42 1.91,75.56 1.91,12.06 1.91,19.68 1.91,27.3 1.91,34.93 1.91,42.55 1.91,50.16 1.91,59.05 9.53,12.06 75.56,12.06 67.94,12.06 75.56,19.68 75.56,27.3 75.56,34.93 75.56,42.55 75.56,50.16 75.56,59.05 75.56,67.94 75.56,106.05 75.56,98.42 75.56,90.8 75.56,83.18 75.56,75.56 66.67,106.05 66.67,116.2 59.05,116.2 51.44,116.2 43.82,116.2 10.79,116.2 18.41,116.2 26.04,116.2 33.66,116.2 38.73,116.2 10.79,106.05 2.54,91.99 2.54,81.99
  pour Bottom: 0,108.27 9.53,108.27 9.53,118.11 67.94,118.11 67.94,108.27 77.47,108.27 77.47,9.84 0,9.84
  pour Top: 0,108.27 9.53,108.27 9.53,118.11 67.94,118.11 67.94,108.27 77.47,108.27 77.47,9.84 0,9.84
N$1  (via drill 0.3)
  Top 0.254: C2.1 26.04,61.59 26.04,62.61 26.29,62.87 Q1.2 26.04,61.91 25.08,61.91 18.48,68.52 18.41,68.52 v18.41,68.58
  Bottom 0.254: IC1.1 16.25,70.74 v18.41,68.58
N$2  (via drill 0.3)
  Top 0.254: v17.46,73.66 25.15,73.66 Q1.1 26.29,73.02 26.04,74.3 C1.1
  Bottom 0.254: IC1.2 17.05,73.25 v17.46,73.66
N$3
  Top 0.254: LED1.A 5.5,102.45 LED.A R9.1
N$12
  Bottom 0.254: IC1.27 14.83,66.67 13.34,66.67 12.06,65.41 C7.1
RESET  (via drill 0.3)
  Top 0.254: v16.19,62.55 16.19,61.28 20.95,56.52 37.47,56.52 38.73,55.25 41.27,55.25 X5.20
  Bottom 0.254: IC1.24 16.19,63.74 v16.19,62.55
VCC  (via drill 0.3)
  Top 0.254: R9.2 4.45,78.42 9.21,73.66 v9.21,70.48
  Top 0.508: X1.1 9.21,70.18 v9.21,70.48 | IC2.14 v25.08,81.91 20.95,81.91 18.33,79.29 v18.33,76.83 20,76.83 21.91,78.74 40.64,78.74 X5.2
  Bottom 0.254: C4.1 26.34,83.8 25.08,82.55 v25.08,81.91 | C6.1 18.65,75.25 18.65,75.56
  Bottom 0.508: IC1.4 18.65,75.56 18.65,76.83 v18.33,76.83 12.06,76.83 9.21,73.98 v9.21,70.48 9.47,70.74 12.38,70.74 | 12.38,70.74 13.65,70.74 | 13.65,70.74 IC1.32 | IC1.31 13.88,69.94 13.02,70.8 13.03,70.8 | 13.03,70.8 C5.1 | C3.1 12.06,71.06 12.38,70.74 | 13.03,70.8 13.6,70.8 13.65,70.74

### Text on the board
tPlace: +